# Altium schematic sheet 命中判断电路.SchDoc
size A4
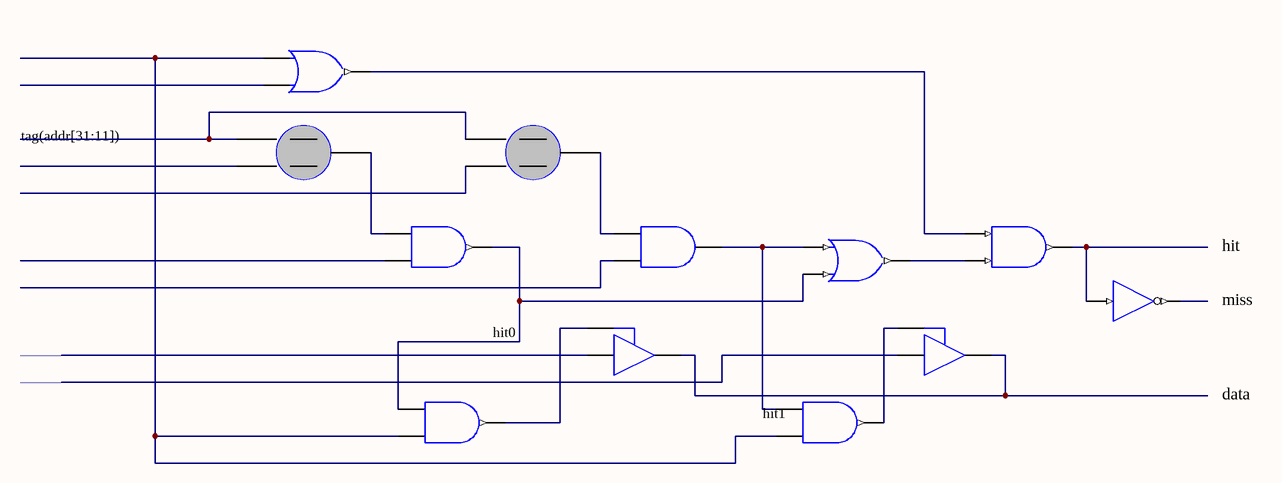
[diagram p0: 命中判断电路.SchDoc]

## Parts
(Parts that share a designator on the sheet are numbered #1, #2 ... from top to bottom, then left to right.)
1  Compare  (value not drawn)
*  Compare  (value not drawn)
U1  (no value)  [DIP-14]  (part A of 4)
U3  (no value)  [DIP-14]  (part A of 4)
U?#1  74F32  [DIP-14]  (value not drawn)  (part A of 4)
U?#2  74F08  [DIP-14]  (value not drawn)  (part A of 4)
U?#3  74F08  [DIP-14]  (value not drawn)  (part A of 4)
U?#4  74F08  [DIP-14]  (value not drawn)  (part A of 4)
U?#5  74F32  [DIP-14]  (value not drawn)  (part A of 4)
U?#6  74F04  [DIP-14]  (value not drawn)  (part A of 6)
U?#7  74F08  [DIP-14]  (value not drawn)  (part A of 4)
U?#8  74F08  [DIP-14]  (value not drawn)  (part A of 4)

## Nets
GND: U1.7(GND) U3.7(GND) U?#1.7(GND) U?#2.7(GND) U?#3.7(GND) U?#4.7(GND) U?#5.7(GND) U?#6.7(GND) U?#7.7(GND) U?#8.7(GND)
VCC: U1.14(VCC) U3.14(VCC) U?#1.14(VCC) U?#2.14(VCC) U?#3.14(VCC) U?#4.14(VCC) U?#5.14(VCC) U?#6.14(VCC) U?#7.14(VCC) U?#8.14(VCC)
Net1_0: 1.0 *.0
Net1_2: 1.2 U?#2.1(A)
Net*_2: *.2 U?#3.1(A)
NetU1_1: U1.1(G) U?#8.3(Y)
NetU1_3: U1.3(Y) U3.3(Y)
NetU3_1: U3.1(G) U?#7.3(Y)
NetU?#1_1: U?#1.1(A) U?#7.2(B) U?#8.2(B)
NetU?#1_3: U?#1.3(Y) U?#4.1(A)
NetU?#2_3: U?#2.3(Y) U?#5.2(B) U?#7.1(A)
NetU?#3_3: U?#3.3(Y) U?#5.1(A) U?#8.1(A)
NetU?#4_2: U?#4.2(B) U?#5.3(Y)
NetU?#4_3: U?#4.3(Y) U?#6.1(A)

Not connected (* = marked no-connect by the designer): 1 1; * 1; U1 2(A); U3 2(A); U?#1 2(B); U?#2 2(B); U?#3 2(B); U?#6 2(Y)

## Notes on the sheet
- ld
- ld || st
- st
- tag0_loaded
- tag1_loaded
- tag(addr[31:11])
- valid0
- (near U?#2) hit0
- (near U?#3) hit1
- (near U?#4) hit0 + hit1
- hit
- valid1
- hit0
- miss
- data0
- data1
- data
- (near U?#8) hit1

## Library data of the parts
U1 U3 = 74F126: Quad Bus Buffer Gate with 3-State Output
U?#1 U?#5 = 74F32: Quad 2-Input Positive-OR Gate
U?#2-U?#4 U?#7 U?#8 = 74F08: Quad 2-Input Positive-AND Gate
U?#6 = 74F04: Hex Inverter